# Altium schematic sheet Heater.SchDoc
size A4; SheetNumber: 2; SheetTotal: 4; SPICEModelCacheERHLMARL: <root> / <DocumentId>ERHLMARL</DocumentId> / <CacheFrame Number="0"> / <Model Name="jmk107abj106_a-t" Kind="CKT"> / <Text>* JMK107ABJ106_A-T     SPICE MODEL  ( General Type ) / *-------------------------------------------------------------------------------------------------------- / * Model Generated by TAIYO YUDEN Corporation (http://www.ty-top.com) / * Version 1.0 / * TAIYO YUDEN Control No. 170508_161201 / * Copyright(c) 2012 TAIYO YUDEN CO.,LTD. All Rights Reserved. / *-------------------------------------------------------------------------------------------------------- / * / * Products Name : Multilayer Ceramic Capacitors / * / * Characteristics : / *     Capacitance : 10 uF , Rated Voltage : 6.3V , TCC : X5R / *     Case Size : 1.6 x 0.8 / 0.063 x 0.031 [mm/inch] , Thickness : 0.8 / 0.031 [mm/inch] / *     (Conditions: Temperature = 25 degC , DC Bias Current/Voltage = 0A / 0V) / * / * Frequency Range : 40Hz - 3GHz / * / * External Node Assignments : / * / *  1  o---| |---o  2 / * / *-------------------------------------------------------------------------------------------------------- / .SubCkt JMK107ABJ106_A-T 1 2 / **************************** / C0 1 110 8.9623u / Cm 1 101 0.8356u / C1 101 102 0.81545u / Rc1 101 102 407.78 / C2 102 103 0.12008u / Rc2 102 103 130 / C3 103 110 0.025876u / Rc3 103 110 15.28 / C2m 1 301 1.9009u / C21 301 302 2.2016u / Rc21 301 302 2.0077k / C22 302 303 2.8092u / Rc22 302 303 1.4498k / C23 303 304 5.2572u / Rc23 303 304 495.97 / C24 304 305 1.3408u / Rc24 304 305 104.84 / C25 305 306 2.2469u / Rc25 305 306 43.602 / C26 306 307 3.3576u / Rc26 306 307 28.622 / C27 307 308 0.79127u / Rc27 307 308 12.149 / C28 308 309 0.054389u / Rc28 308 309 2.6395 / C29 309 110 958.23p / Rc29 309 110 12.241 / Rp0 1 110 10Meg / L0 110 120 0.23398n / Lm 120 130 0.21547n / L1 120 121 0.13111n / RL1 121 130 0.16354 / L2 120 122 0.18713n / RL2 122 130 0.82225 / L3 120 123 0.35084n / RL3 123 130 0.11873 / CR 120 124 2.098u / LR 124 125 0.50248n / RR 125 130 34.862m / CL 130 140 1.1716p / LL 130 140 0.18847n / RL 130 140 40.014 / Rs 140 2 4.8237m / **************************** / .ends JMK107ABJ106_A-T</Text> / </Model> / </CacheFrame> / </root>
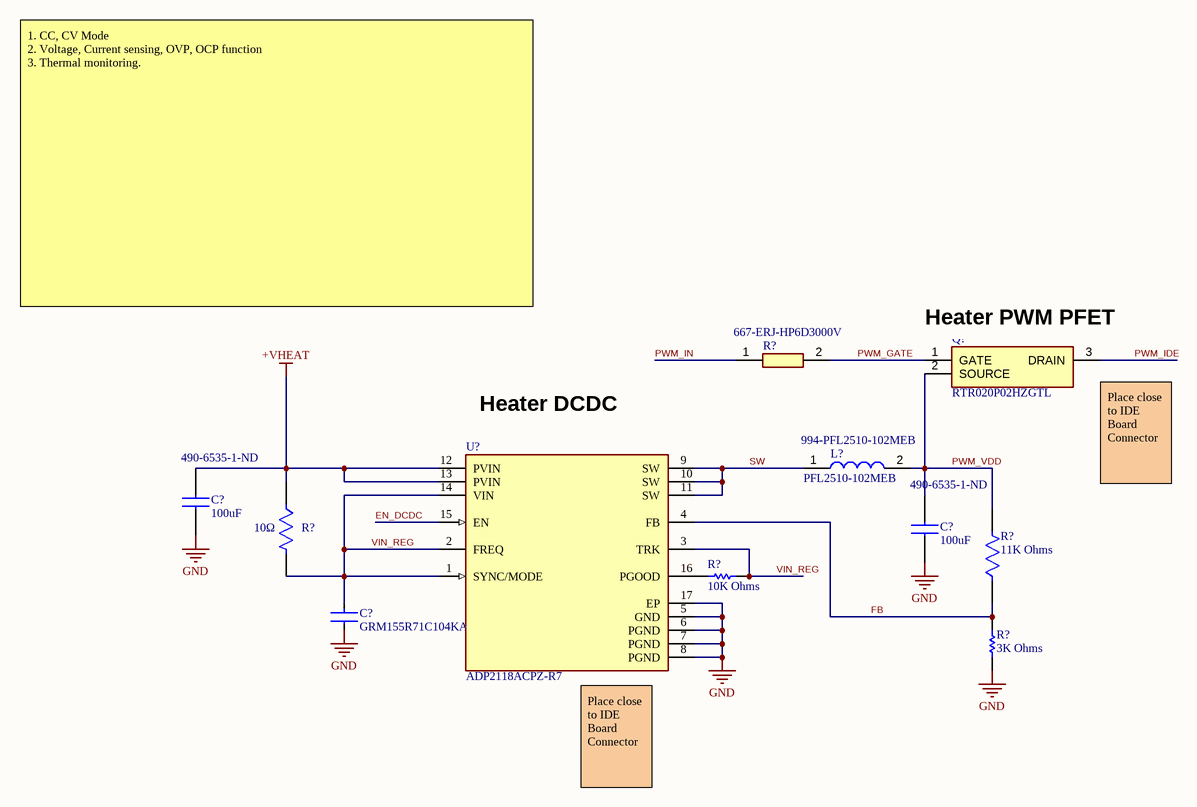
[diagram p0: Heater.SchDoc]

## Parts
(Parts that share a designator on the sheet are numbered #1, #2 ... from top to bottom, then left to right.)
C?#1  100uF  Supplier Part Number 1: 490-6535-1-ND  [CAPC3225X270N]
C?#2  100uF  Supplier Part Number 1: 490-6535-1-ND  [CAPC3225X270N]
C?#3  GRM155R71C104KA88D  [FP-GRM15-MFG]
L?  PFL2510-102MEB  Supplier Part Number 1: 994-PFL2510-102MEB  [PFL2510102MEB]
Q?  RTR020P02HZGTL  [SOT95P280X100-3N]
R?#1  Supplier Part Number 1: 667-ERJ-HP6D3000V  [ERJHP6D1000V]  (hidden comment: ERJHP6D3000V)
R?#2  Resistance: 10Ω  [FP-RT0603-MFG]  (hidden comment: RT0603FRE0710RL)
R?#3  10K Ohms  [RESC1609X55X30LL15T15]
R?#4  11K Ohms  [FP-RT0402-MFG]
R?#5  3K Ohms  [RESC1005X35X25NL10T10]
U?  ADP2118ACPZ-R7  [FP-CP-16-26-IPC_B]

## Nets
+VHEAT: C?#1.1 R?#2.1 U?.12(PVIN) U?.13(PVIN)
GND: C?#1.2 C?#2.2 C?#3.1 R?#5.1 U?.5(GND) U?.6(PGND) U?.7(PGND) U?.8(PGND) U?.17(EP)
EN_DCDC: U?.15(EN)
FB: R?#4.1 R?#5.2 U?.4(FB)
PWM_GATE: Q?.1(GATE) R?#1.2
PWM_IDE: Q?.3(DRAIN)
PWM_IN: R?#1.1
PWM_VDD: C?#2.1 L?.2 Q?.2(SOURCE) R?#4.2
SW: L?.1 U?.9(SW) U?.10(SW) U?.11(SW)
VIN_REG: C?#3.2 R?#2.2 R?#3.1 U?.1(SYNC/MODE) U?.2(FREQ) U?.3(TRK) U?.14(VIN)
NetR?#3_2: R?#3.2 U?.16(PGOOD)

## Notes on the sheet
- 1. CC, CV Mode
  2. Voltage, Current sensing, OVP, OCP function
  3. Thermal monitoring.
- (near Q?) Heater PWM PFET
- (near U?) Heater DCDC
- (near Q?) Place close to IDE Board Connector
- (near U?) Place close to IDE Board Connector
- DWG. NO.
- REV.
- SHT.
- THIS DOCUMENT AND THE DATA DISCLOSED HEREIN OR HEREWITH IS THE PROPERTY OF ALTIUM LIMITED AND MAY BE FREELY DISTRIBUTED IN WHOLE. NO RIGHTS ARE RESERVED OR EXPRESS OR IMPLIED WARANTEE GIVEN.
- REVISION
- DESCRIPTION
- DATE
- APPROVED
- ENG:
- APPROVALS
- PROJECT
- DSN:
- CHK:
- REFERENCE DOCUMENTS
- PROJECT REVISION:
- TITLE
- DOCUMENT REVISION:
- DESIGN ITEM:
- BOM:
- FAB DWG:
- PCB DWG:
- ASSY DWG:
- SCALE:
- SIZE
- B
- CAGE CODE
- FILE NAME
- DWG NO.
- SHEET
- OF
- REV

## Library data of the parts
C?#1 C?#2 = GRM32ER60J107ME20K: Murata 1210 100uF Capacitor GRM32ER60J107ME20K; Manufacturer_Name: Murata Electronics; Datasheet Link: https://datasheet.datasheetarchive.com/originals/distributors/Datasheets_SAMA/ec4f1577dddcc7a13ddad897a28002d3.pdf; Height: 2.7mm; Manufacturer_Part_Number: GRM32ER60J107ME20K; Mouser Part Number: 81-GRM32ER60J107ME0K; Mouser Price/Stock: https://www.mouser.co.uk/ProductDetail/Murata-Electronics/GRM32ER60J107ME20K?qs=giATsht9l5z2kqRlJFg9kQ%3D%3D; Arrow Part Number: GRM32ER60J107ME20K; Arrow Price/Stock: https://www.arrow.com/en/products/grm32er60j107me20k/murata-manufacturing?region=nac; Supplier 1: Digi-Key; Value: 100uF
C?#3 = CMP-2100-03641-2: CAP CER 0.1UF 16V X7R 0402; Manufacturer: Murata; Standoff Height: 0mm; Tolerance: 10%; Voltage Rating: 16Vdc; Material: Ceramic; Capacitance: 0.10μF; Value: 0.10μF; RoHS: TRUE; Manufacturer Part Number: GRM155R71C104KA88D; Temperature Characteristic: X7R; Octopart: https://octopart.com/grm155r71c104ka88d-murata-196880; Digikey Description: CAP CER 0.1UF 16V X7R 0402; Device Class L3: Ceramic Capacitors; Height: 0.55mm; ComponentLink2Description: Datasheet; Temperature Range Low: -55°C; Ipc Land Pattern Name: CAPC10050X219; ComponentLink2URL: https://search.murata.co.jp/Ceramy/image/img/A01X/G101/ENG/GRM155R71H471KA01-01A.pdf; Device Class L1: Passive Components; Lead Free: yes; Category: Cap; Package: GRM15; Temperature: -55°C to +125°C; Device Class L2: Capacitors; Temperature Range High: +125°C; Mouser Description: 0402 0.1 uF 16V ±10 % Tolerance X7R SMT Multilayer Ceramic Capacitor
L? = PFL2510-102MEB: Inductor; Manufacturer_Name: COILCRAFT; Datasheet Link: https://www.coilcraft.com/getmedia/c12c10f7-342b-4ba5-9fed-9b8db38318c5/pfl2510.pdf; Height: 1.02mm; Manufacturer_Part_Number: PFL2510-102MEB; Mouser Part Number: 994-PFL2510-102MEB; Mouser Price/Stock: https://www.mouser.com/Search/Refine.aspx?Keyword=994-PFL2510-102MEB; Supplier 1: Mouser
Q? = RTR020P02HZGTL: Transistor; Manufacturer_Name: ROHM Semiconductor; Datasheet Link: https://componentsearchengine.com/Datasheets/1/RTR020P02HZGTL.pdf; Height: 1mm; Manufacturer_Part_Number: RTR020P02HZGTL; Mouser Part Number: 755-RTR020P02HZGTL; Mouser Price/Stock: https://www.mouser.co.uk/ProductDetail/ROHM-Semiconductor/RTR020P02HZGTL?qs=qSfuJ%252Bfl%2Fd4ZBjtDX1OQNg%3D%3D; Supplier 1: Digi-Key; Supplier Part Number 1: 846-RTR020P02HZGTLCT-ND
R?#1 = ERJHP6D3000V: Resistor; Manufacturer_Name: Panasonic; Datasheet Link: http://industrial.panasonic.com/cdbs/www-data/pdf/RDQ0000/ast-ind-151033.pdf; Height: 0.7mm; Manufacturer_Part_Number: ERJHP6D3000V; Supplier 1: Mouser
R?#2 = CMP-03412-033408-1: RES SMD 10 OHM 1% 1/10W 0603; Manufacturer: Yageo; Voltage Rating: 75V; Power Rating: 0.1W; Temperature Coefficient: 50 ppm/°C; Tolerance: 0.01; Value: 10Ω; Footprint Url: http://www.yageo.com/exep/pages/download/literatures/PYu-R_Mount_10.pdf; Ipc Land Pattern Name: RESC16080X45; RoHS: TRUE; Device Class L2: Resistors; Device Class L3: Chip SMD Resistors; Category: Res; Device Class L1: Passive Components; Manufacturer Part Number: RT0603FRE0710RL; ComponentLink2URL: http://www.yageo.com/documents/recent/PYu-RT_1-to-0.01_RoHS_L_9.pdf; Temperature Range Low: -55°C; Height: 0.55mm; Digikey Description: RES SMD 10 OHM 1% 1/10W 0603; Temperature Range High: +155°C; Lead Free: Yes; Composition: Thin Film; Mouser Description: Thin Film Resistors - SMD 1/10W 10 ohm 1% 50ppm; Automotive: No; Package: RT0603; Temperature: -55°C to +155°C; Series: RT; ComponentLink2Description: Datasheet; Octopart: https://octopart.com/rt0603fre0710rl-yageo-39827693
R?#3 = CMP-1012-00623-3: Chip Resistor, 10 KOhm, +/- 1%, 0.1 W, -55 to 155 degC, 0603 (1608 Metric), ERJ3EKF1002V; Manufacturer: Panasonic; Voltage Rating: 75V; Case\/Package: 0603; Power Rating: 100mW; Resistance: 10KOhm; Temperature Coefficient: 100ppm\/degreesC; Number of Pins: 2; Package Reference: 603; Depth: 0.8mm; Mount: SurfaceMount; Package Description: 2-Pin Surface Mount Device, Body 1.6 x 0.85 mm; Datasheet Version: 02/2017; Length: 1.6mm; Lead Free: LeadFree; Height: 0.45mm; Number of Terminations: 2; Max Power Dissipation: 100mW; Min Operating Temperature: -55degC; Datasheet URL: https://industrial.panasonic.com/cdbs/www-data/pdf/RDA0000/AOA0000C304.pdf; Termination: SMD/SMT; Case Code (Metric): 1608; Case Code (Imperial): 0603; Tolerance: 1%; Max Operating Temperature: 155degC; RoHSCompliant: true; Voltage Rating (DC): 75V; Radiation Hardening: No; Packaging: TapeandReel; Composition: ThickFilm; Mounting Technology: SurfaceMount; Manufacturer URL: http://www.panasonic.com/; Width: 0.031inch; REACH SVHC: NoSVHC; Contact Plating: Tin; Military Standard: Not; Package Quantity: 1
R?#4 = CMP-03412-023742-1: Yageo RES SMD 11K OHM 0.5% 1/16W 0402 RT0402DRE0711KL; Value: 11KΩ; Power Rating: 0.063W; Tolerance: 0.005; Voltage Rating: 50V; Temperature Coefficient: 50 ppm/°C; Composition: Thin Film; Lead Free: Yes; Manufacturer Part Number: RT0402DRE0711KL; ComponentLink2URL: http://www.yageo.com/documents/recent/PYu-RT_1-to-0.01_RoHS_L_9.pdf; Device Class L3: Chip SMD Resistors; Resistance: 11KΩ; Temperature Range High: +155°C; Height: 0.35mm; Octopart: https://octopart.com/rt0402dre0711kl-yageo-1240623; Automotive: No; Manufacturer: Yageo; Device Class L1: Passive Components; Ipc Land Pattern Name: RESC10050X30; Series: RT; ComponentLink2Description: Datasheet; RoHS: TRUE; Category: Res; Temperature: -55°C to +155°C; Device Class L2: Resistors; Package: RT0402; Temperature Range Low: -55°C; Footprint Url: http://www.yageo.com/exep/pages/download/literatures/PYu-R_Mount_10.pdf; Digikey Description: RES SMD 11K OHM 0.5% 1/16W 0402
R?#5 = CMP-2002-02648-1: Yageo 3K Ohms 0402 RT0402FRE073KL; Manufacturer: Yageo; Part Number: RT0402FRE073KL
U? = CMP-09139-000158-1: IC REG BUCK ADJ 3A 16LFCSP; Min Output Voltage: 600mV; Output Type: Adjustable; Output Configuration: Positive; Min Input Voltage: 2.3V; Number of Outputs: 1; Operating Supply Current: 150uA; Synchronous Rectifier: Yes; Max Output Voltage: 5.5V; Switching Frequency: 1.2MHz; Output Current: 3A; Number of Pins: 16; Lead Free: Contains Lead; Max Operating Temperature: 125°C; Packaging: Tape and Reel; RoHS Compliant: Yes; Case/Package: LFCSP EP; Max Output Current: 3A; Mount: Surface Mount; Min Operating Temperature: -40°C; Output Voltage: 5.5V; Operating Supply Voltage: 5.5V; Nominal Supply Current: 150uA; Series: -; Max Input Voltage: 5.5V; Termination: SMD/SMT; Contact Plating: Tin; REACH SVHC: No SVHC